# EAGLE design squall (EAGLE 6.5.0)
AUTHOR: Brad Campbell; REV: A; TITLE: Squall

## Sheet 1 of 2: nRF51822
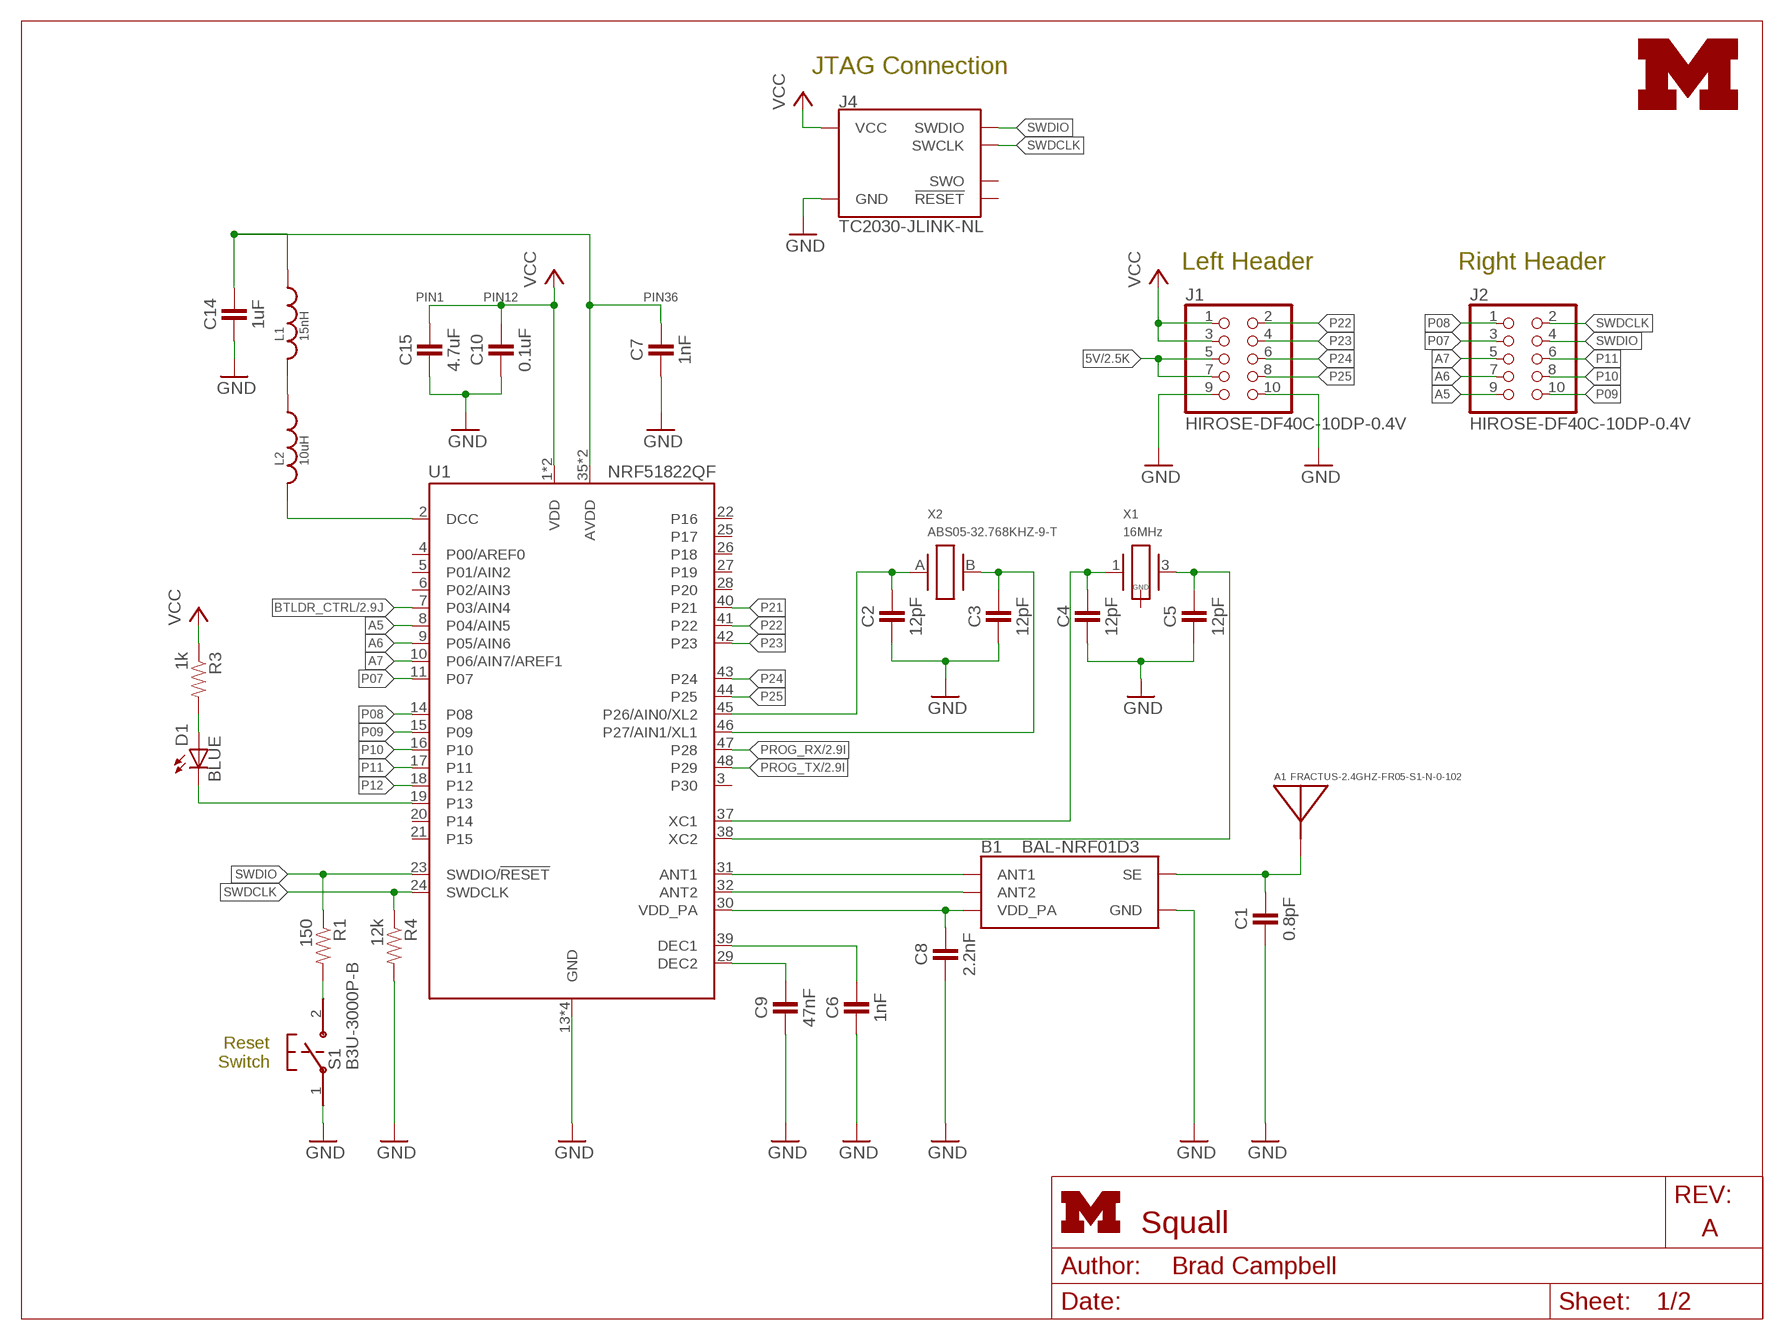
[diagram p0: schematic, sheet 1]
FRAME1 (LETTER_L): HEIGHT: 8.5in; WIDTH: 11in

### Parts
A1  FRACTUS-2.4GHZ-FR05-S1-N-0-102  [FRACTUS-ANTENNA-FR05-S1-N-0-102]
B1  BAL-NRF01D3  [BAL-NRF01D3]
C1  0.8pF  CAPACITOR  [0402_CAP]
C2  12pF  CAPACITOR  [0402_CAP]
C3  12pF  CAPACITOR  [0402_CAP]
C4  12pF  CAPACITOR  [0402_CAP]
C5  12pF  CAPACITOR  [0402_CAP]
C6  1nF  CAPACITOR  [0402_CAP]
C7  1nF  CAPACITOR  [0402_CAP]
C8  2.2nF  CAPACITOR  [0402_CAP]
C9  47nF  CAPACITOR  [0402_CAP]
C10  0.1uF  CAPACITOR  [0402_CAP]
C14  1uF  CAPACITOR  [0402_CAP]
C15  4.7uF  CAPACITOR  [0402_CAP]
D1  BLUE  LED0603  [LED-0603]
J1  HIROSE-DF40C-10DP-0.4V  [2X5/SMD/0.4MM]
J2  HIROSE-DF40C-10DP-0.4V  [2X5/SMD/0.4MM]
J4  TC2030-JLINK-NL  [TC2030-IDC-NL]
L1  15nH  INDUCTOR0402  [0402_CAP]
L2  10uH  INDUCTOR0603  [0603_CAP]
LOGO1  UMICH_SOLID_TINY  [UMICH_SOLID_50MIL]
R1  150  RESISTOR  [0402_RES]
R3  1k  RESISTOR  [0402_RES]
R4  12k  RESISTOR  [0402_RES]
S1  B3U-3000P-B  [B3U-3000P-B]
U1  NRF51822QF  [QFN-48-6MM]
X1  16MHz  TXC-8Y  [TXC-8Y]
X2  ABS05-32.768KHZ-9-T  [ABS05]

### Nets
5V: J1.5 J1.7 ; also sheet 2
A0: C2.1 U1.45(P26/AIN0/XL2) X2.A
A1: C3.1 U1.46(P27/AIN1/XL1) X2.B
A5: J2.9 U1.8(P04/AIN5)
A6: J2.7 U1.9(P05/AIN6)
A7: J2.5 U1.10(P06/AIN7/AREF1)
AVDD: C7.1 C14.1 L1.1 U1.35(AVDD) U1.36(AVDD)
BTLDR_CTRL: U1.7(P03/AIN4) ; also sheet 2
DCC: L2.2 U1.2(DCC)
GND: B1.GND C1.2 C2.2 C3.2 C4.2 C5.2 C6.2 C7.2 C8.2 C9.2 C10.2 C14.2 C15.2 J1.9 J1.10 J4.5(GND) R4.2 S1.1 U1.13(GND) U1.33(GND) U1.34(GND) U1.GND ; also sheet 2
N$5: B1.ANT1 U1.31(ANT1)
N$6: B1.ANT2 U1.32(ANT2)
N$7: D1.C U1.19(P13)
N$8: R1.2 S1.2
N$11: A1.1(ANTENNA) B1.SE C1.1
N$14: L1.2 L2.1
N$16: C4.1 U1.37(XC1) X1.1
N$17: C5.1 U1.38(XC2) X1.3
N$18: C6.1 U1.39(DEC1)
N$19: C9.1 U1.29(DEC2)
N$23: D1.A R3.2
P07: J2.3 U1.11(P07)
P08: J2.1 U1.14(P08)
P09: J2.10 U1.15(P09)
P10: J2.8 U1.16(P10)
P11: J2.6 U1.17(P11)
P12: U1.18(P12)
P21: U1.40(P21)
P22: J1.2 U1.41(P22)
P23: J1.4 U1.42(P23)
P24: J1.6 U1.43(P24)
P25: J1.8 U1.44(P25)
PROG_RX: U1.47(P28) ; also sheet 2
PROG_TX: U1.48(P29) ; also sheet 2
SWDCLK: J2.2 J4.4(SWCLK) R4.1 U1.24(SWDCLK)
SWDIO: J2.4 J4.2(SWDIO) R1.1 U1.23(SWDIO/!RESET)
VCC: C10.1 C15.1 J1.1 J1.3 J4.1(VCC) R3.1 U1.1(VDD) U1.12(VDD) ; also sheet 2
VDD_PA: B1.VCC(VDD_PA) C8.1 U1.30(VDD_PA)
Unconnected: J4.3(!RESET) J4.6(SWO) U1.3(P30) U1.4(P00/AREF0) U1.5(P01/AIN2) U1.6(P02/AIN3) U1.20(P14) U1.21(P15) U1.22(P16) U1.25(P17) U1.26(P18) U1.27(P19) U1.28(P20) X1.2(GND) X1.4(GND)

### Notes on the sheet
- JTAG Connection
- Left Header | Right Header
- PIN1 | PIN12 | PIN36
- Reset
  Switch

## Sheet 2 of 2: Programmer and Batteries
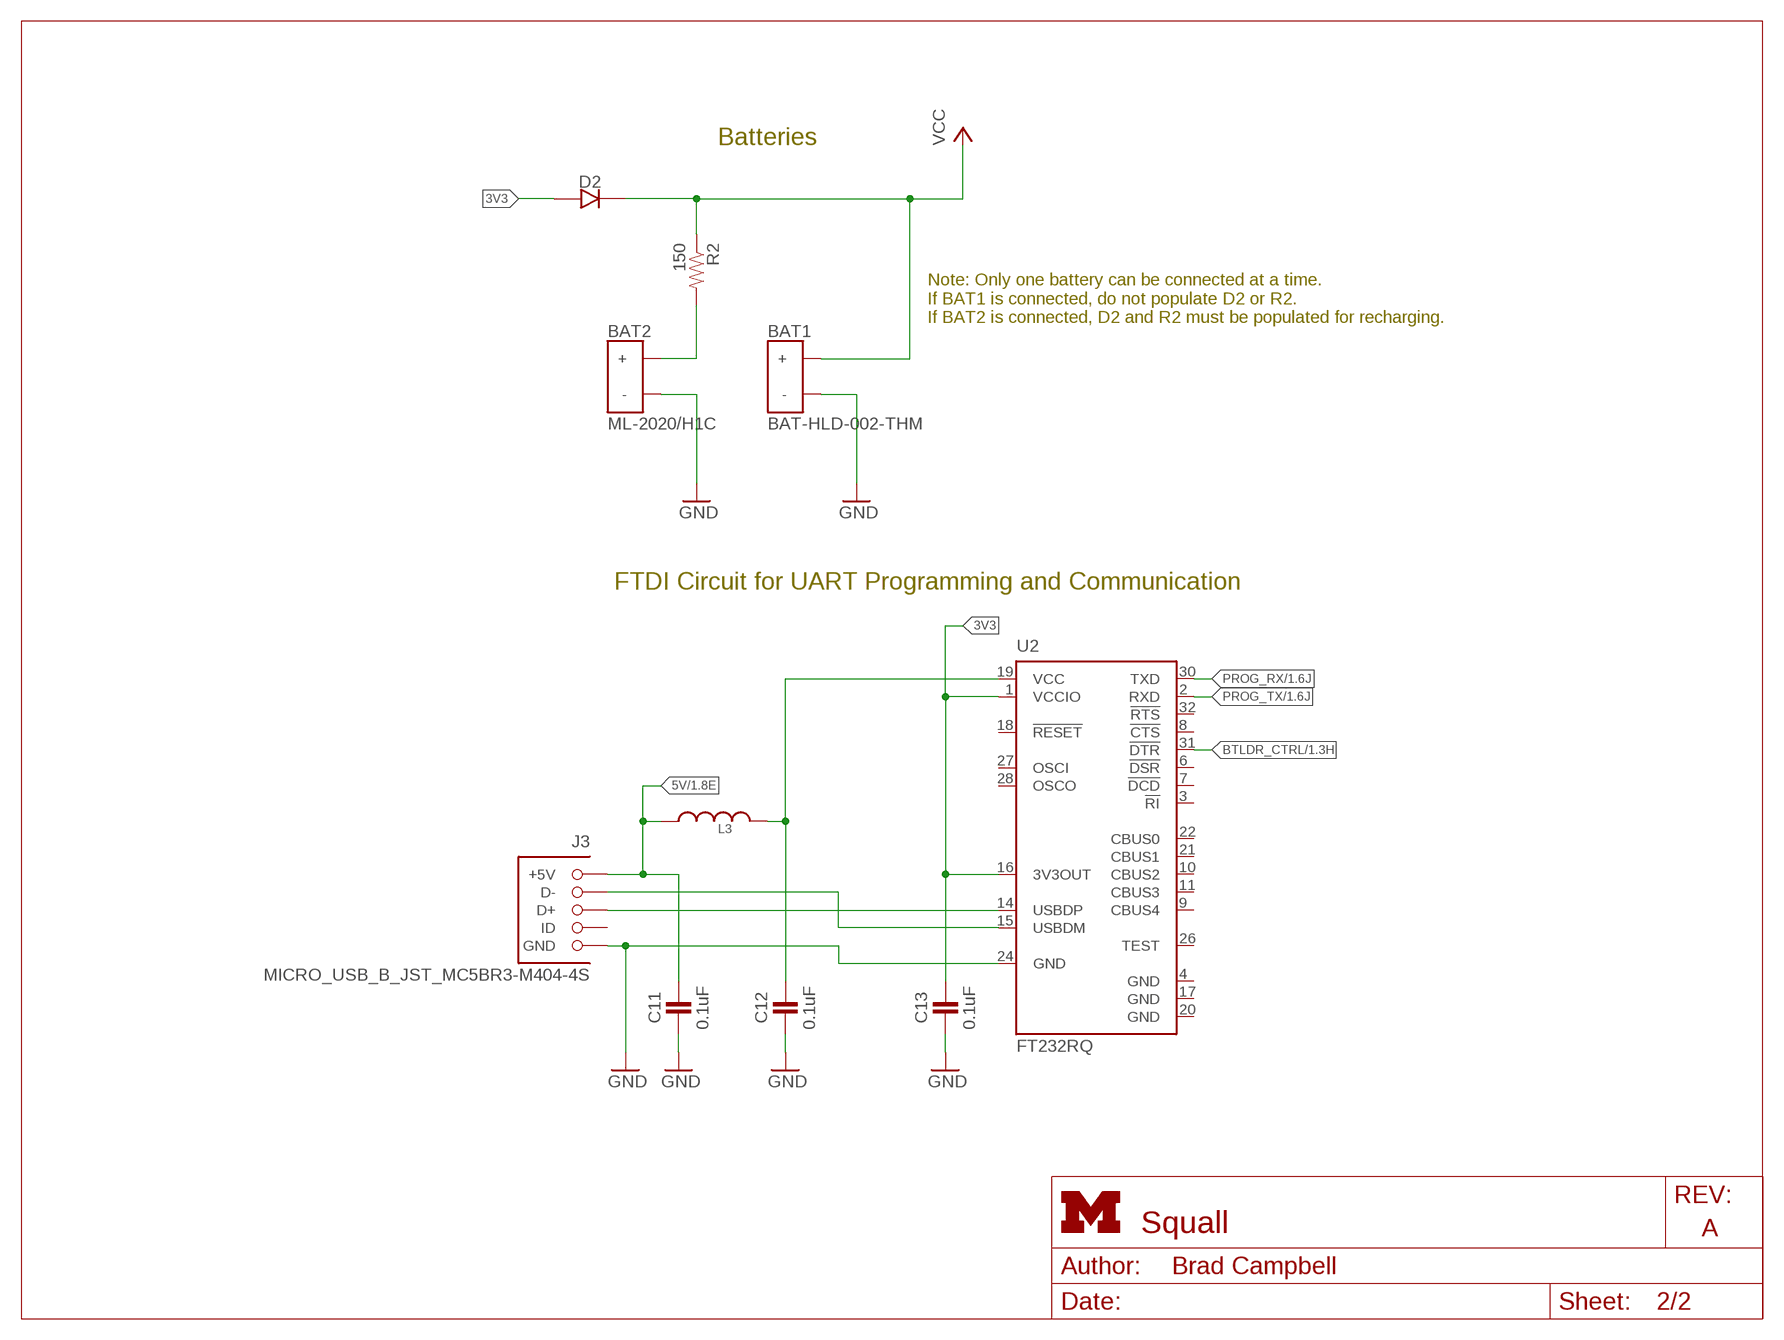
[diagram p1: schematic, sheet 2]
FRAME2 (LETTER_L): HEIGHT: 8.5in; WIDTH: 11in

### Parts
BAT1  BAT-HLD-002-THM  [BAT-HLD-002-THM]
BAT2  ML-2020/H1C  [ML-2020/H1C]
C11  0.1uF  CAPACITOR  [0402_CAP]
C12  0.1uF  CAPACITOR  [0402_CAP]
C13  0.1uF  CAPACITOR  [0402_CAP]
D2  DIODE  [0402_DIODE]
J3  MICRO_USB_B_JST_MC5BR3-M404-4S  [USB_MICRO_B-JST-MC5BR3-M404-4S-TB]
L3  INDUCTOR0402  [0402_CAP]
R2  150  RESISTOR  [0402_RES]
U2  FT232RQ  [QFN32]

### Nets
3V3: C13.1 D2.ANODE U2.1(VCCIO) U2.16(3V3OUT)
5V: C11.1 J3.1(+5V) L3.1 ; also sheet 1
BTLDR_CTRL: U2.31(!DTR) ; also sheet 1
FTDI_VCC: C12.1 L3.2 U2.19(VCC)
GND: BAT1.GND(-) BAT2.NEG(-) C11.2 C12.2 C13.2 J3.5(GND) U2.24(GND) ; also sheet 1
N$1: BAT2.POS(+) R2.2
N$26: J3.3(D+) U2.14(USBDP)
N$27: J3.2(D-) U2.15(USBDM)
PROG_RX: U2.30(TXD) ; also sheet 1
PROG_TX: U2.2(RXD) ; also sheet 1
VCC: BAT1.POS1(+) BAT1.POS2(+) BAT1.POS3(+) BAT1.POS4(+) D2.CATHODE R2.1 ; also sheet 1
Unconnected: J3.4(ID) U2.3(!RI) U2.6(!DSR) U2.7(!DCD) U2.8(!CTS) U2.9(CBUS4) U2.10(CBUS2) U2.11(CBUS3) U2.18(!RESET) U2.21(CBUS1) U2.22(CBUS0) U2.26(TEST) U2.27(OSCI) U2.28(OSCO) U2.32(!RTS)

### Notes on the sheet
- Batteries
- Note: Only one battery can be connected at a time.
  If BAT1 is connected, do not populate D2 or R2.
  If BAT2 is connected, D2 and R2 must be populated for recharging.
- FTDI Circuit for UART Programming and Communication

## Power pins joined to a net without a drawn wire
GND: U2.4(GND) U2.17(GND) U2.20(GND)

## Library data of the parts
A1 = chips:FRACTUS-2.4GHZ-FR05-S1-N-0-102: Fractus Compact Reach XtendTM chip antenna is engineered specifically for Bluetooth, WLAN 802.11 b/g/n and other wireless devices operating at the ISM 2.4 GHz band. Compact Reach Xtend combines small form factor size and high performance to improve the functionality of your wireless devices.; RICHARDSON_RFPD: FR05-S1-N-0102B
B1 = chips:BAL-NRF01D3: 50 ohm nominal input / conjugate match balun to nRF51422-QFAA, nRF24LE1, nRF51822-QFAA/AB, with integrated harmonic filter; DIGIKEY: 497-13637-1-ND; MOUSER: 511-BAL-NRF01D3
BAT1 = batteries:BAT-HLD-002-THM: RETAINER BATT CR2016 PC PINS; DIGIKEY: BAT-HLD-002-THM-ND; MOUSER: 712-BAT-HLD-002-THM
BAT2 = batteries:ML-2020/H1C: BATT LITH COIN 3V RECHARGE PINS 45mAh; DIGIKEY: P047-ND; MOUSER: 658-ML-2020/H1CN
C1 C8 = passives:CAPACITOR: 0402 Capacitor; DIGIKEY: 490-5419-1-ND
C2-C5 = passives:CAPACITOR: 0402 Capacitor; DIGIKEY: 490-6197-1-ND
C6 C7 = passives:CAPACITOR: 0402 Capacitor; DIGIKEY: 490-1303-1-ND
C9 = passives:CAPACITOR: 0402 Capacitor; DIGIKEY: 445-1264-1-ND
C10 = passives:CAPACITOR: 0402 Capacitor; DIGIKEY: 445-4952-1-ND
C11-C13 = passives:CAPACITOR: 0402 Capacitor; DIGIKEY: 490-1318-6-ND
C14 = passives:CAPACITOR: 0402 Capacitor; DIGIKEY: 1276-1513-1-ND
C15 = passives:CAPACITOR: 0402 Capacitor; DIGIKEY: 445-5947-1-ND
D1 = SparkFun-LED:LED: LEDs Standard schematic elements and footprints for 5mm, 3mm, 1206, and 0603 sized LEDs. 5mm - Spark Fun Electronics SKU : COM-00529 (and others)
D2 = passives:DIODE; DIGIKEY: 641-1271-1-ND; MOUSER: 750-CDBQR0130L
J1 J2 = headers:HIROSE-DF40C-10DP-0.4V: DF40 Series Header - 0.4MM Pitch; DIGIKEY: H11616CT-ND; MOUSER: 798-DF40C10DP0.4V51; NEWARK: 68X2585
J3 = connector:MICRO_USB_B_JST_MC5BR3-M404-4S: Micro USB B mid mount; DIGIKEY: 455-2567-2-ND; MOUSER: 53X3655
J4 = connector:TC2030-JLINK
L1 = passives:INDUCTOR; DIGIKEY: 587-1521-1-ND
L2 = passives:INDUCTOR; DIGIKEY: 490-4025-1-ND
L3 = passives:INDUCTOR; DIGIKEY: 445-2979-1-ND
LOGO1 = logos:UMICH_SOLID
R1 R2 = passives:RESISTOR: Resistor Basic schematic elements and footprints for 0603, 1206, and PTH resistors.; DIGIKEY: RHM150CDCT-ND
R3 = passives:RESISTOR: Resistor Basic schematic elements and footprints for 0603, 1206, and PTH resistors.; DIGIKEY: RHM1.0KCECT-ND
R4 = passives:RESISTOR: Resistor Basic schematic elements and footprints for 0603, 1206, and PTH resistors.; DIGIKEY: RHM12.0KCDCT-ND
S1 = switches:B3U; DIGIKEY: SW1256CT-ND
U1 = chips:NRF51822: Multiprotocol Bluetooth® 4.0 low energy/2.4 GHz RF SoC; DIGIKEY: 1490-1032-1-ND; MOUSER: 949-NRF51822-QFAB-R7
U2 = ftdichip:FT232R: Source: http://www.ftdichip.com/Documents/DataSheets/DS_FT232R_v104.pdf; MPN: FT232RQ; OC_FARNELL: 1146033; OC_NEWARK: 91K9919
X1 = crystals:TXC-8Y: 2mmx1.6mm SMD Crystal; DIGIKEY: 887-2003-1-ND
X2 = crystals:ABS05-32.768KHZ: 32.768kHz Crystal; DIGIKEY: 535-11897-1-ND

## Board
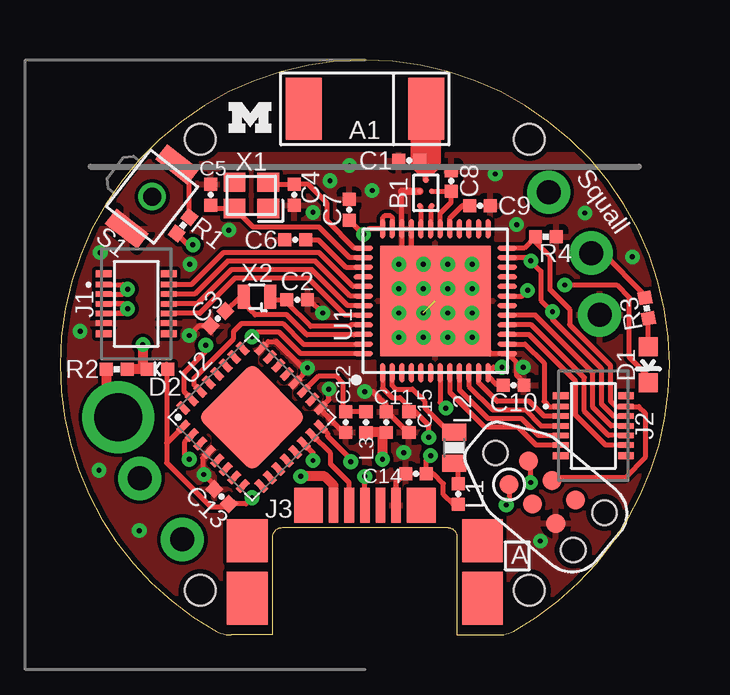
[diagram p2: board, top side]
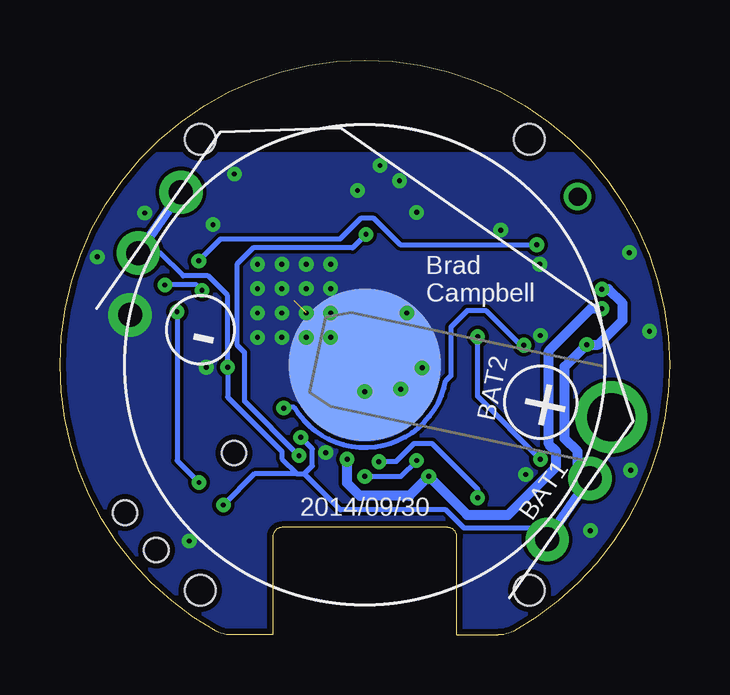
[diagram p3: board, bottom side, seen from below]

Size 25.4 x 23.95 mm. Coordinates in mm from the lower left corner, seen from the top.
Outline: 8.87,0 7.14,0 arc-29 6.5,0.15 arc-61 0,11.25 arc-90 12.7,23.95 arc-90 25.4,11.25 arc-61 18.9,0.15 arc-29 18.26,0 16.54,0
Copper layers (1*16): Top 0.0178mm / dielectric 12mil / Bottom 0.0178mm
Design rules "sunstone-4lyr_v1.0.0.3 *": minimum track width 6mil, minimum drill 8mil, track to track 6mil, track to pad 6mil, pad to pad 6mil, via to via 6mil, smd to smd 6mil, copper to edge 10mil, drill to drill 16mil, minimum pad ring 8mil, minimum via ring 8mil, stop-mask expansion 3mil, vias tented up to drill 8mil, thermal gap 10mil
Holes 1.27 mm at 19.56,20.65 5.84,20.65 5.84,1.85 19.56,1.85

### Footprints (pad centres in the part's own frame; a part is rotated, then mirrored left to right if it is on the bottom)
FRACTUS-ANTENNA-FR05-S1-N-0-102 = smd 1.5 x 2.6: 1 -2.55,0; 2 2.55,0
BAL-NRF01D3 = smd 0.22 x 0.22: ANT1 -0.537,-0.25; ANT2 -0.537,0.25; GND 0.069,0.25; SE 0.537,0; VCC 0.069,-0.25
BAT-HLD-002-THM = smd 6.35 x 6.35: GND 0,0 | drill 1 pad 1.8: POS1 -10.4,1.5; POS2 -10.4,-1.6; POS3 10.4,1.5; POS4 10.4,-1.6
ML-2020/H1C = drill 1 pad 1.8: NEG -10,0 | drill 2 pad 2.3: POS 10.5,0
0402_CAP = smd 0.536 x 0.546: 1 -0.433,0; 2 0.433,0
LED-0603 = smd 0.8 x 0.8: A 0,-0.75; C 0,0.75
0402_DIODE = smd 0.536 x 0.546: ANODE -0.433,0; CATHODE 0.433,0
2X5/SMD/0.4MM = smd 0.66 x 0.23: 1 -1.355,0.8; 2 1.355,0.8; 3 -1.355,0.4; 4 1.355,0.4; 5 -1.355,0; 6 1.355,0; 7 -1.355,-0.4; 8 1.355,-0.4; 9 -1.355,-0.8; 10 1.355,-0.8 | smd 0.66 x 0.3: A -1.355,1.25; B 1.355,1.25; C -1.355,-1.25; D 1.355,-1.25
USB_MICRO_B-JST-MC5BR3-M404-4S-TB = smd 0.4 x 1.45: 1 -1.3,3.875; 2 -0.65,3.875; 3 0,3.875; 4 0.65,3.875; 5 1.3,3.875 | smd 1.7 x 2.2: P$1 -4.9,0; P$2 4.9,0 | smd 1.7 x 1.8: P$3 -4.9,2.4; P$4 4.9,2.4 | smd 1.2 x 1.45: P$5 -2.35,3.875; P$6 2.35,3.875
TC2030-IDC-NL = smd 0.787 x 0.787: 1 -1.27,-0.635; 2 -1.27,0.635; 3 0,-0.635; 4 0,0.635; 5 1.27,-0.635; 6 1.27,0.635 | hole 1.016: -2.54,0; 2.54,1.016; 2.54,-1.016
0603_CAP = smd 0.7 x 1: 1 -0.65,0; 2 0.65,0
0402_RES = smd 0.536 x 0.546: 1 -0.433,0; 2 0.433,0
B3U-3000P-B = smd 0.8 x 1.7: 1 -1.7,0; 2 1.7,0 | drill 0.75: P$1 0,0
QFN-48-6MM = smd 0.8 x 0.203: 1 -3,2.2; 2 -3,1.8; 3 -3,1.4; 4 -3,1; 5 -3,0.6; 6 -3,0.2; 7 -3,-0.2; 8 -3,-0.6; 9 -3,-1; 10 -3,-1.4; 11 -3,-1.8; 12 -3,-2.2; 25 3,-2.2; 26 3,-1.8; 27 3,-1.4; 28 3,-1; 29 3,-0.6; 30 3,-0.2; 31 3,0.2; 32 3,0.6; 33 3,1; 34 3,1.4; 35 3,1.8; 36 3,2.2 | smd 0.203 x 0.8: 13 -2.2,-3; 14 -1.8,-3; 15 -1.4,-3; 16 -1,-3; 17 -0.6,-3; 18 -0.2,-3; 19 0.2,-3; 20 0.6,-3; 21 1,-3; 22 1.4,-3; 23 1.8,-3; 24 2.2,-3; 37 2.2,3; 38 1.8,3; 39 1.4,3; 40 1,3; 41 0.6,3; 42 0.2,3; 43 -0.2,3; 44 -0.6,3; 45 -1,3; 46 -1.4,3; 47 -1.8,3; 48 -2.2,3 | smd 4.6 x 4.6: GND 0,0
QFN32 = smd 0.6 x 0.3: 1 -2.3,1.75; 2 -2.3,1.25; 3 -2.3,0.75; 4 -2.3,0.25; 5 -2.3,-0.25; 6 -2.3,-0.75; 7 -2.3,-1.25; 8 -2.3,-1.75; 17 2.3,-1.75; 18 2.3,-1.25; 19 2.3,-0.75; 20 2.3,-0.25; 21 2.3,0.25; 22 2.3,0.75; 23 2.3,1.25; 24 2.3,1.75 | smd 0.3 x 0.6: 9 -1.75,-2.3; 10 -1.25,-2.3; 11 -0.75,-2.3; 12 -0.25,-2.3; 13 0.25,-2.3; 14 0.75,-2.3; 15 1.25,-2.3; 16 1.75,-2.3; 25 1.75,2.3; 26 1.25,2.3; 27 0.75,2.3; 28 0.25,2.3; 29 -0.25,2.3; 30 -0.75,2.3; 31 -1.25,2.3; 32 -1.75,2.3 | smd 3.2 x 3.2: EXP 0,0
TXC-8Y = smd 0.9 x 0.8: 1 -0.7,-0.55; 2 0.7,-0.55; 3 0.7,0.55; 4 -0.7,0.55
ABS05 = smd 0.5 x 1: A -0.55,0; B 0.55,0

### Placement (x,y rotation side)
A1  12.7,21.92 180 top
B1  15.24,18.41 90 top
BAT1  12.7,11.25 325 bottom
BAT2  12.7,11.25 348 bottom
C1  14.55,19.76 180 top
C2  9.88,13.97 0 top
C3  6.58,13.18 225 top
C4  9.75,18.34 270 top
C5  6.27,18.34 90 top
C6  9.8,16.46 180 top
C7  12.05,17.71 90 top
C8  16.3,18.91 90 top
C9  17.5,17.88 0 top
C10  18.9,10.41 0 top
C11  13.59,8.86 90 top
C12  11.91,8.86 270 top
C13  6.73,5.77 135 top
C14  14.83,6.71 180 top
C15  14.54,8.86 270 top
D1  24.51,11.25 180 top
D2  4.06,11.07 180 top
J1  3.17,13.79 0 top
J2  22.23,8.71 0 top
J3  12.7,1.52 0 top
J4  20.09,5.94 320 top
L1  16.59,5.87 90 top
L2  16.43,7.8 90 top
L3  12.75,8.86 90 top
LOGO1  7.92,21.56 0 top
R1  5.13,17.06 52 top
R2  2.36,11.07 180 top
R3  24.45,13.61 280 top
R4  20.24,16.59 0 top
S1  3.84,18.26 52 top
U1  15.64,13.92 90 top
U2  8,9.07 45 top
X1  7.98,18.31 180 top
X2  8.2,14.1 180 top

### Tracks (layer width: path | path; a pad name or v marks a point on that pad's centre or on a via)
3V3  (via drill 0.2)
  Top 0.203: 5.14,8.67 U2.1 4.45,7.99 | U2.16 11.15,8.39 11.15,8.28 12.12,7.32 v12.12,7.21 | 4.45,7.99 4.45,11.28 D2.ANODE | 4.45,7.99 4.45,7.16 6.27,5.33 6.91,5.33 C13.1 7.75,5.46 v8,5.72
  Bottom 0.203: v8,5.72 8,6.07 9.91,7.98 10.64,7.98 11.4,7.21 v12.12,7.21
5V  (via drill 0.2)
  Top 0.229: J1.5 2.62,13.79 v2.82,13.59 2.62,13.39 J1.7
  Top 0.406: J3.1 11.4,6.23 11.02,6.6 v10.03,6.6 | L3.1 C11.1 13.44,8.28 v13.44,7.32
  Bottom 0.406: v2.82,13.59 3.28,13.59 5.03,11.84 5.03,7.95 4.72,7.65 4.72,7.01 6.73,5 8.43,5 v10.03,6.6 10.85,5.79 12.9,5.79 13.44,6.32 v13.44,7.32
A0
  Top 0.203: U1.45 12.13,12.92 12.06,12.85 10.44,12.85 9.45,13.84 C2.1 8.88,13.97 X2.A
A1
  Top 0.203: U1.46 12.26,12.52 12.24,12.5 10.29,12.5 9.45,13.34 8.13,13.34 7.93,13.53 X2.B 7.52,14.1 C3.1
A5
  Top 0.203: U1.8 16.24,10.1 17.68,8.66 19.07,8.66 19.82,7.91 J2.9
A6
  Top 0.203: U1.9 16.64,10.21 17.83,9.02 19.23,9.02 19.93,8.31 J2.7
A7
  Top 0.203: U1.10 17.04,10.37 18.03,9.37 19.38,9.37 20.04,8.71 J2.5
AVDD  (via drill 0.2)
  Top 0.203: U1.35 13.84,17.4 13.74,17.48 13.54,17.48 13.44,17.38 U1.36 12.88,16.92 v12.65,16.69 12.59,16.74 C7.1 | L1.1 16.38,5.43 15.98,5.84 15.98,6.3 15.57,6.71 C14.1 15.27,7.29 v15.44,7.47
  Bottom 0.203: v15.44,7.47 17.7,9.73 17.7,11.76 18.01,12.07 18.01,15.47 17.35,16.13 13.21,16.13 v12.65,16.69
BTLDR_CTRL  (via drill 0.2)
  Top 0.203: U2.31 5.18,10.12 5.18,10.92 6.07,11.81 v6.07,12.07 | U1.7 15.84,9.69 v16.08,9.45
  Bottom 0.203: v16.08,9.45 16.05,9.47 15.65,9.47 arc-138 9.32,10.59 9.12,10.8 9.12,12.83 8.43,13.51 7.64,13.51 6.2,12.07 v6.07,12.07
DCC
  Top 0.203: U1.2 13.84,10.39 13.99,10.24 14.68,10.24 15.21,9.7 15.21,9.45 16.22,8.45 L2.2
FTDI_VCC
  Top 0.203: U2.19 10.79,10.8 11.48,10.8 11.79,10.49 11.79,9.42 C12.1 L3.2
GND  (via drill 0.2)  (1 unrouted)
  Top 0.203: U2.24 8.68,12.22 9.02,12.22 10.11,11.13 | 10.11,11.13 10.11,10.82 U2.20 | C12.2 11.81,8.43 10.87,9.38 U2.17 11.2,9.79 v11.2,10.24 | v10.31,11.13 10.11,11.13 | C15.2 14.48,8.43 13.97,8.97 13.64,9.3 C11.2 13.59,9.58 13.03,10.13 v12.7,10.13 | U2.4 5.94,7.36 5.94,6.73 v5.99,6.68 6.42,6.25 C13.2 | C10.2 19.41,10.44 19.02,10.82 19.02,11.33 U1.13 17.98,11.72 v17.17,12.4 | J3.5 14,6.38 C14.2 | 14.24,18.48 U1.34 14.24,15.69 v14.12,15.44 14.64,16.09 U1.33 | v15.14,12.4 v14.12,12.4 | C2.2 10.39,13.97 v10.95,13.41 | C3.2 5.79,12.88 v5.38,12.47
  Top 0.305: B1.GND 14.24,18.48
  Bottom 0.203: v12.7,10.13 12.14,9.58 10.34,9.58
  other vias: 14.33,7.59 15.14,14.43 16.15,14.43 17.17,14.43 14.12,14.43 15.14,15.44 16.15,15.44 17.17,15.44 17.17,13.41 16.15,13.41 14.12,13.41 15.14,13.41 16.15,12.4 11.25,18.92 13,18.52 10.54,17.6 19.02,17.09 3.3,4.34 21.87,17.58 20.02,3.91 19.3,11.15 7.04,16.87 5.41,15.44 1.68,15.93 18.14,19.2 12.06,19.56 23.85,15.75 1.63,6.86 0.84,12.65
  pour Top: -1.27,20.02 14.5,20.02 14.5,16.64 16.1,16.64 16.1,20.02 26.67,20.02 26.67,-2.72 -1.27,-2.72
  pour Bottom (no thermals): 26.67,-2.72 26.67,20.02 -1.27,20.02 -1.27,-2.72
N$1
  Top 0.406: R2.2 1.93,9.57 BAT2.POS
N$5
  Top 0.203: B1.ANT1 15.44,17.83 U1.31
N$6
  Top 0.203: B1.ANT2 15.04,17.83 U1.32
N$7  (via drill 0.2)
  Top 0.203: U1.19 19.25,14.12 v19.48,14.35 | v21.03,14.58 23.19,14.58 23.72,14.05 23.72,11.56 24.51,10.77 D1.C
  Bottom 0.203: v21.03,14.58 19.71,14.58 v19.48,14.35
N$8
  Top 0.203: R1.2 5.39,19.09 S1.2
N$11
  Top 0.203: 15.24,19.29 15.24,19.76
  Top 0.254: B1.SE 15.24,19.29
  Top 0.762: 15.24,19.76 C1.1 | 15.24,21.91 A1.1
  Top 1.27: 15.24,19.76 15.24,21.91
N$14
  Top 0.203: L1.2 16.59,7 L2.1
N$16
  Top 0.203: U1.37 12.25,16.12 11.12,17.25 11.12,17.98 10.34,18.77 C4.1 8.31,18.77 X1.1
N$17
  Top 0.203: U1.38 12.07,15.72 10.79,16.99 8.05,16.99 X1.3 6.42,17.76 C5.1
N$18
  Top 0.203: C6.1 10.77,16.46 11.91,15.32 U1.39
N$19
  Top 0.203: U1.29 16.24,17.36 16.76,17.88 C9.1
N$23
  Top 0.203: D1.A 24.51,13.18 R3.2
N$26  (via drill 0.2)
  Top 0.203: J3.3 v12.7,6.6 | U2.14 10.54,7.59 v10.54,7.26
  Bottom 0.203: v12.7,6.6 11.2,6.6 v10.54,7.26
N$27
  Top 0.203: J3.2 12.05,6.34 11.28,7.11 11.28,7.56 U2.15
P07
  Top 0.203: J2.3 20.17,9.11 19.56,9.73 18.21,9.73 17.44,10.5 U1.11
P08
  Top 0.203: U1.14 19.38,12.12 20.17,11.33 20.17,9.73 20.38,9.51 J2.1
P09
  Top 0.203: U1.15 19.54,12.52 21.46,10.59 21.46,9.17 22.72,7.91 J2.10
P10
  Top 0.203: U1.16 19.64,12.92 21.84,10.72 21.84,9.32 22.85,8.31 J2.8
P11
  Top 0.203: U1.17 19.8,13.32 22.2,10.92 22.2,9.47 22.96,8.71 J2.6
P22
  Top 0.203: U1.41 12.2,14.52 10.79,15.93 6.81,15.93 5.47,14.59 J1.2
P23
  Top 0.203: U1.42 12.1,14.12 10.64,15.57 6.99,15.57 5.61,14.19 J1.4
P24
  Top 0.203: U1.43 11.99,13.72 10.49,15.21 7.14,15.21 5.71,13.79 J1.6
P25
  Top 0.203: U1.44 11.88,13.32 10.34,14.86 7.29,14.86 5.82,13.39 J1.8
PROG_RX
  Top 0.203: U1.47 10.13,12.12 9.27,12.98 7.57,12.98 7.24,12.65 7.24,12.34 5.59,10.69 5.59,10.42 U2.30
PROG_TX  (via drill 0.2)
  Top 0.203: U1.48 10.02,11.72 9.14,12.6 8.18,12.6 v8,12.42 | U2.2 5.18,8.02 5.18,7.52 v5.38,7.32
  Bottom 0.203: v8,12.42 8,9.93 v5.38,7.32
SWDCLK
  Top 0.203: U1.24 19.34,16.12 R4.1 19.81,16.36 20.42,15.75 20.42,14.38 21.23,13.56 21.23,12.93 22.94,11.23 22.94,9.75 23.18,9.51 J2.2 24.12,9.51 24.38,9.25 24.38,7.39 23.55,6.55 20.62,6.55 J4.4
SWDIO  (via drill 0.2)
  Top 0.203: 19.05,15.72 U1.23 19.48,15.72 v19.62,15.58 20.04,15.16 20.04,13.94 v20.52,13.46 20.52,13.13 22.55,11.1 22.55,9.63 23.07,9.11 J2.4 | v19.61,6.35 19.61,7.16 J4.2 | v5.54,16.26 5.33,16.26 R1.1
  Bottom 0.203: v20.52,13.46 20.52,7.26 v19.61,6.35 | v5.54,16.26 11.23,16.26 12.32,17.35 12.88,17.35 13.74,16.48 18.71,16.48 v19.62,15.58
VCC  (via drill 0.2)
  Top 0.203: U1.1 13.44,10.28 13.84,9.88 14.17,9.88 14.54,9.51 C15.1 14.81,9.3 15.37,8.74 v15.37,8.23 | U1.12 17.84,10.81 | J1.1 2.63,14.59 v2.82,14.4 2.61,14.19 J1.3 | C10.1 18.22,10.41 17.84,10.79 U1.12 | U1.12 18.07,11.15 v18.41,11.15 | J4.1 18.71,5.53 v18.59,5.41 | R3.1 24.37,14.16 22.62,15.91 BAT1.POS2
  Top 0.406: R2.1 D2.CATHODE 3.45,11.25 v3.45,12.09
  Bottom 0.203: 15.21,6.71 14.88,7.04 14.88,7.75 v15.37,8.23 | BAT1.POS4 5.57,4.45 8.56,4.45 9.32,5.21 13.72,5.21 15.21,6.71 | 15.52,6.71 17.3,6.71 v18.59,5.41 | 15.52,6.71 16.15,7.34 16.15,7.65 18.41,9.91 v18.41,11.15 18.41,14.15 19.23,14.96 20.27,14.96 21.21,15.91 BAT1.POS2 | 15.52,6.71 15.21,6.71
  Bottom 0.406: v2.82,14.4 2.55,14.4 1.96,13.81 1.96,13.11 2.97,12.09 v3.45,12.09 4.37,11.18 4.37,8.18 3.83,7.65 3.83,7.03 BAT1.POS3 BAT1.POS4 | BAT1.POS2 BAT1.POS1
VDD_PA
  Top 0.203: U1.30 15.84,17.57 16.3,18.03 C8.1 B1.VCC

### Text on the board
tPlace: Squall | A
bPlace: Brad / Campbell | 2014/09/30